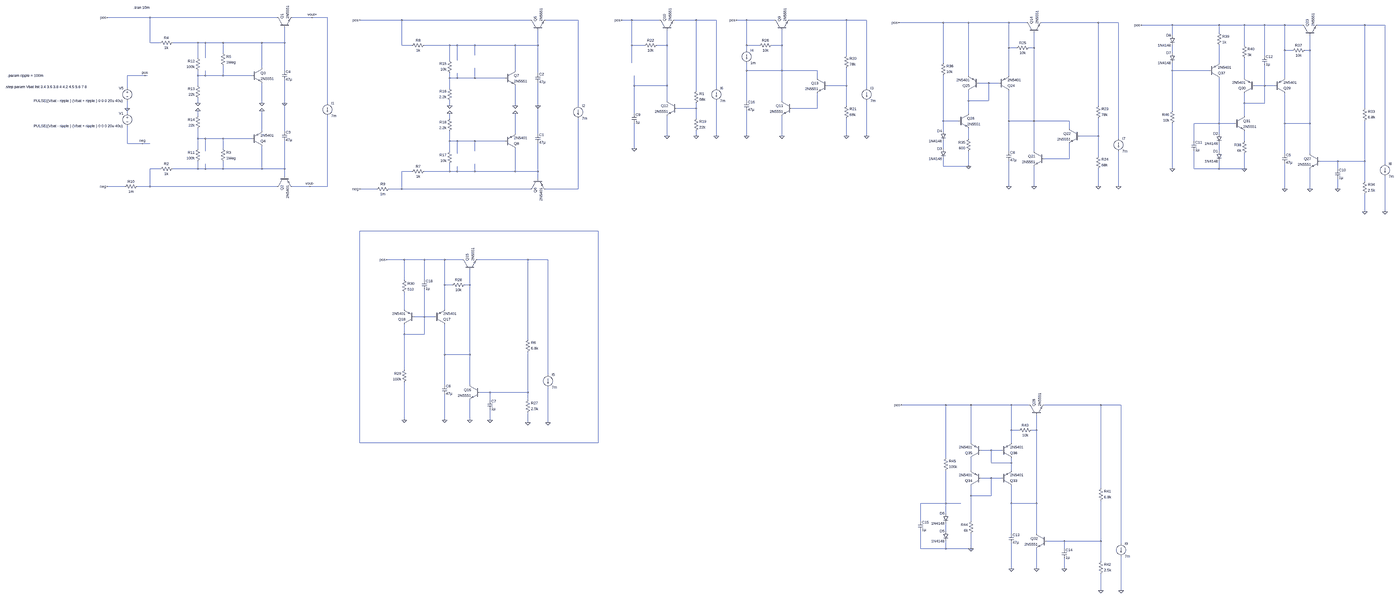
[diagram p0: schematic complete_linear_regulator.asc, whole sheet]
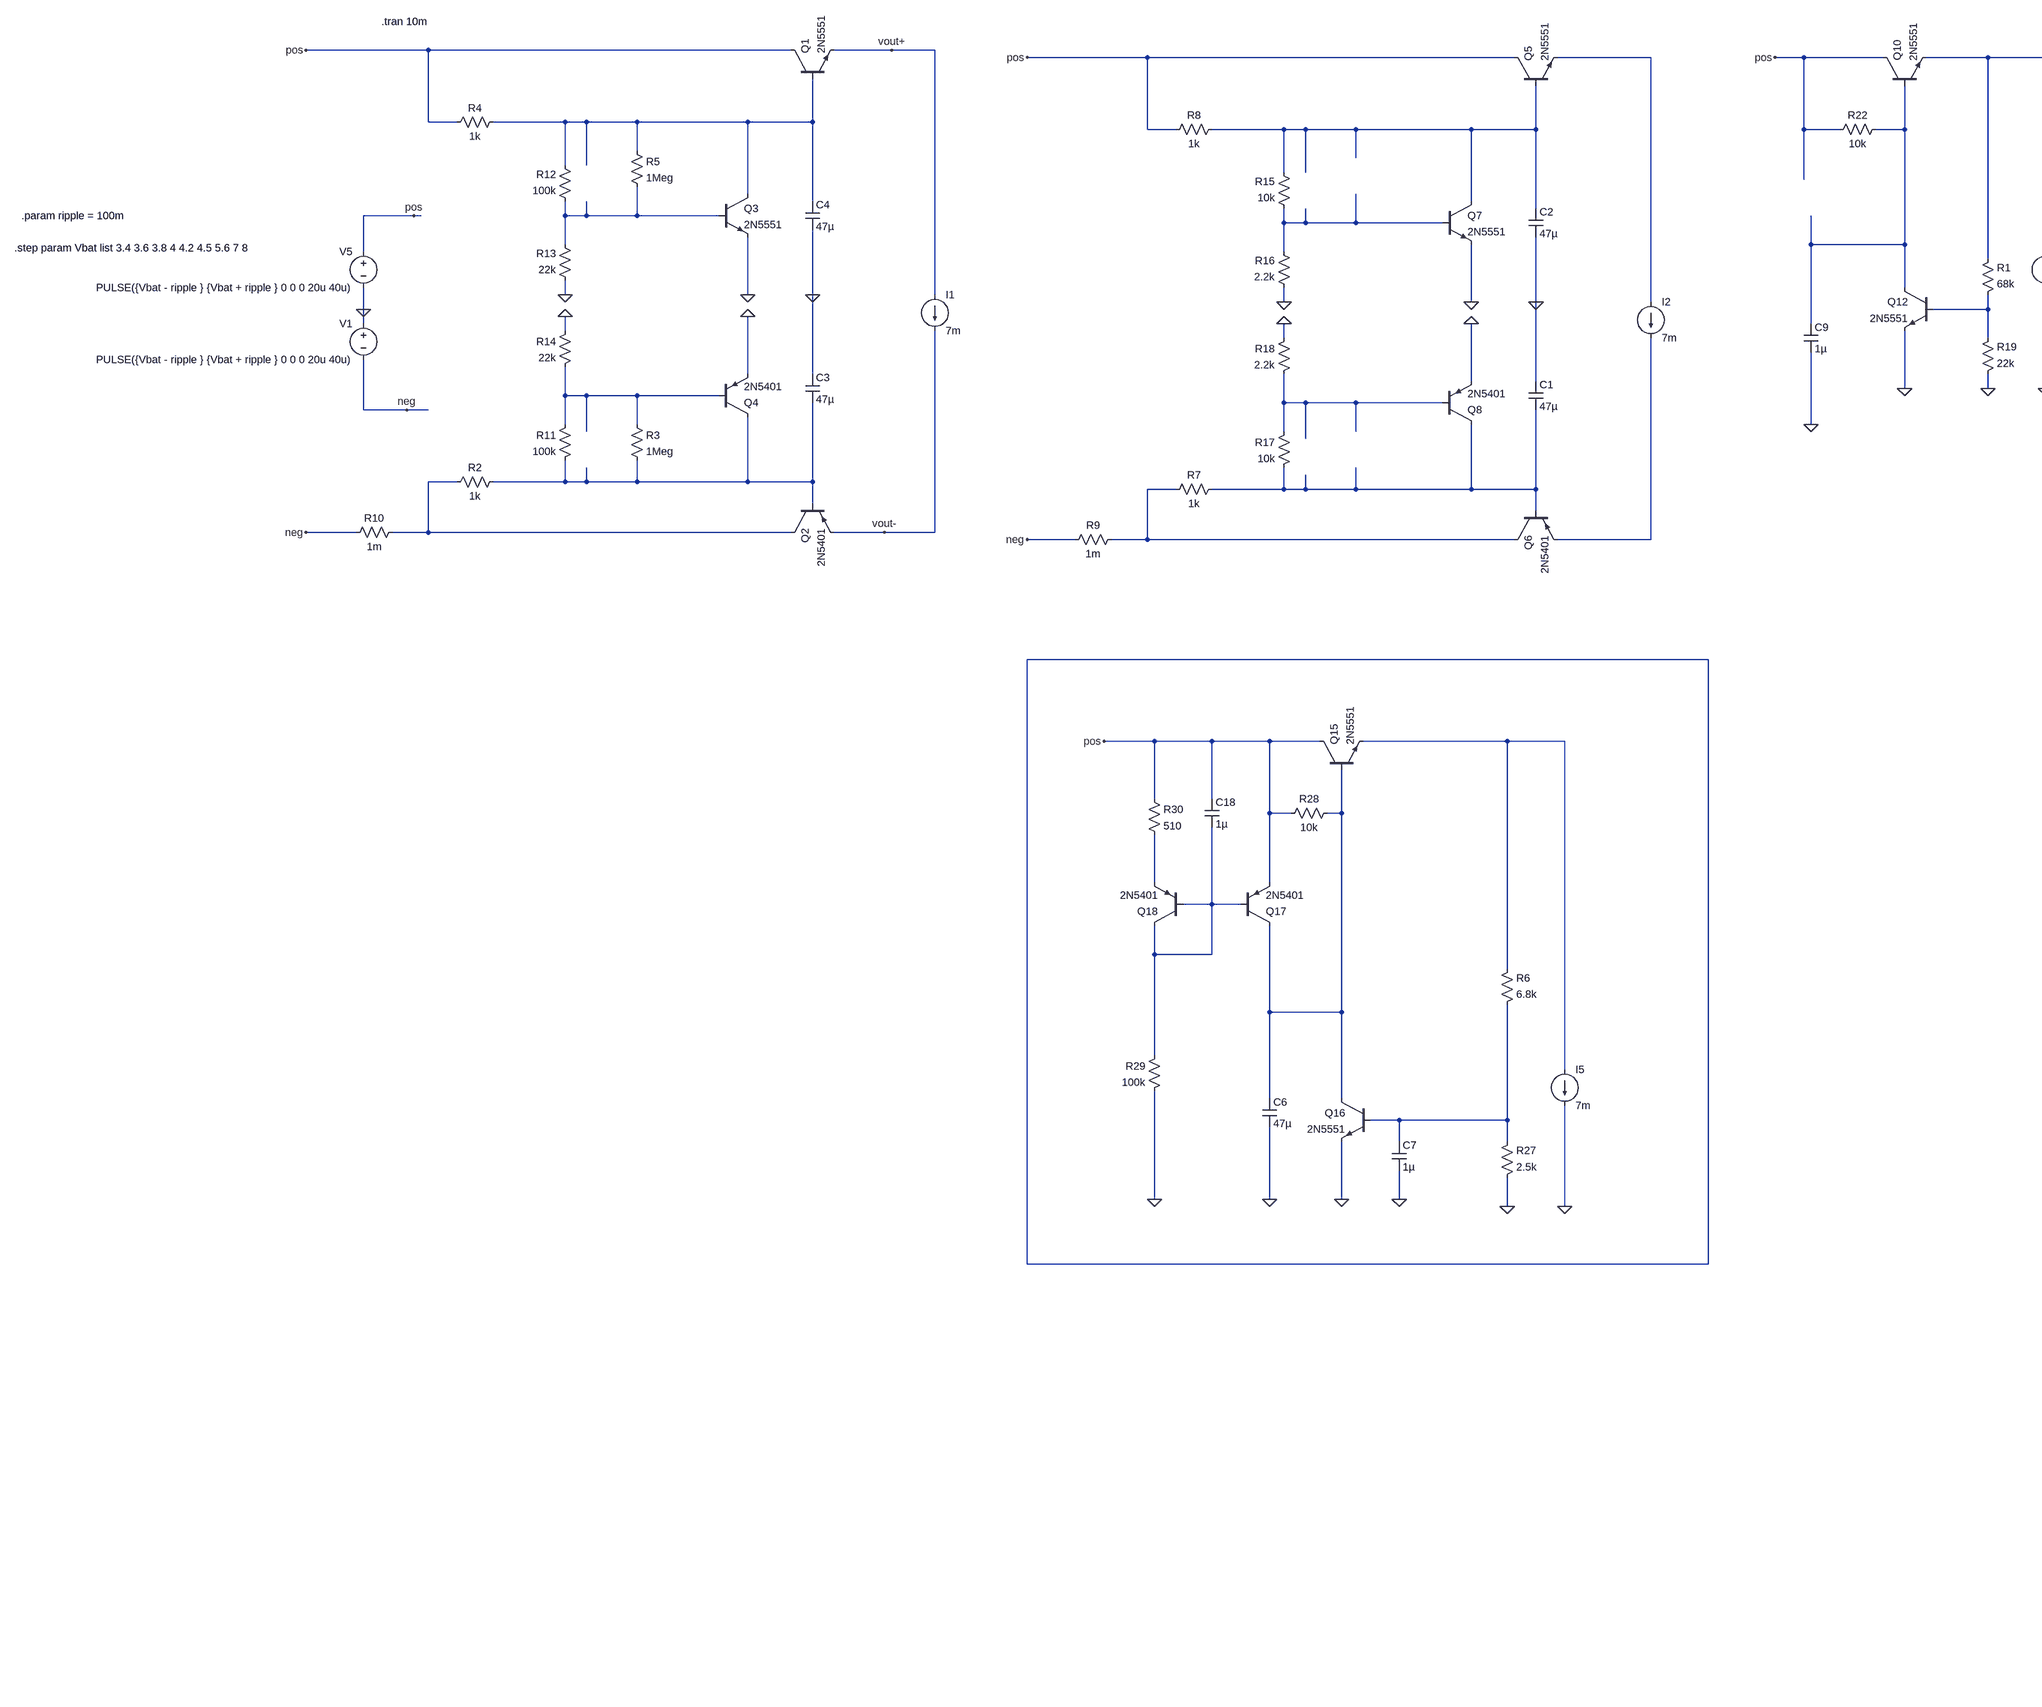
[diagram p1: schematic complete_linear_regulator.asc, part, row 1 of 1, column 1 of 2]
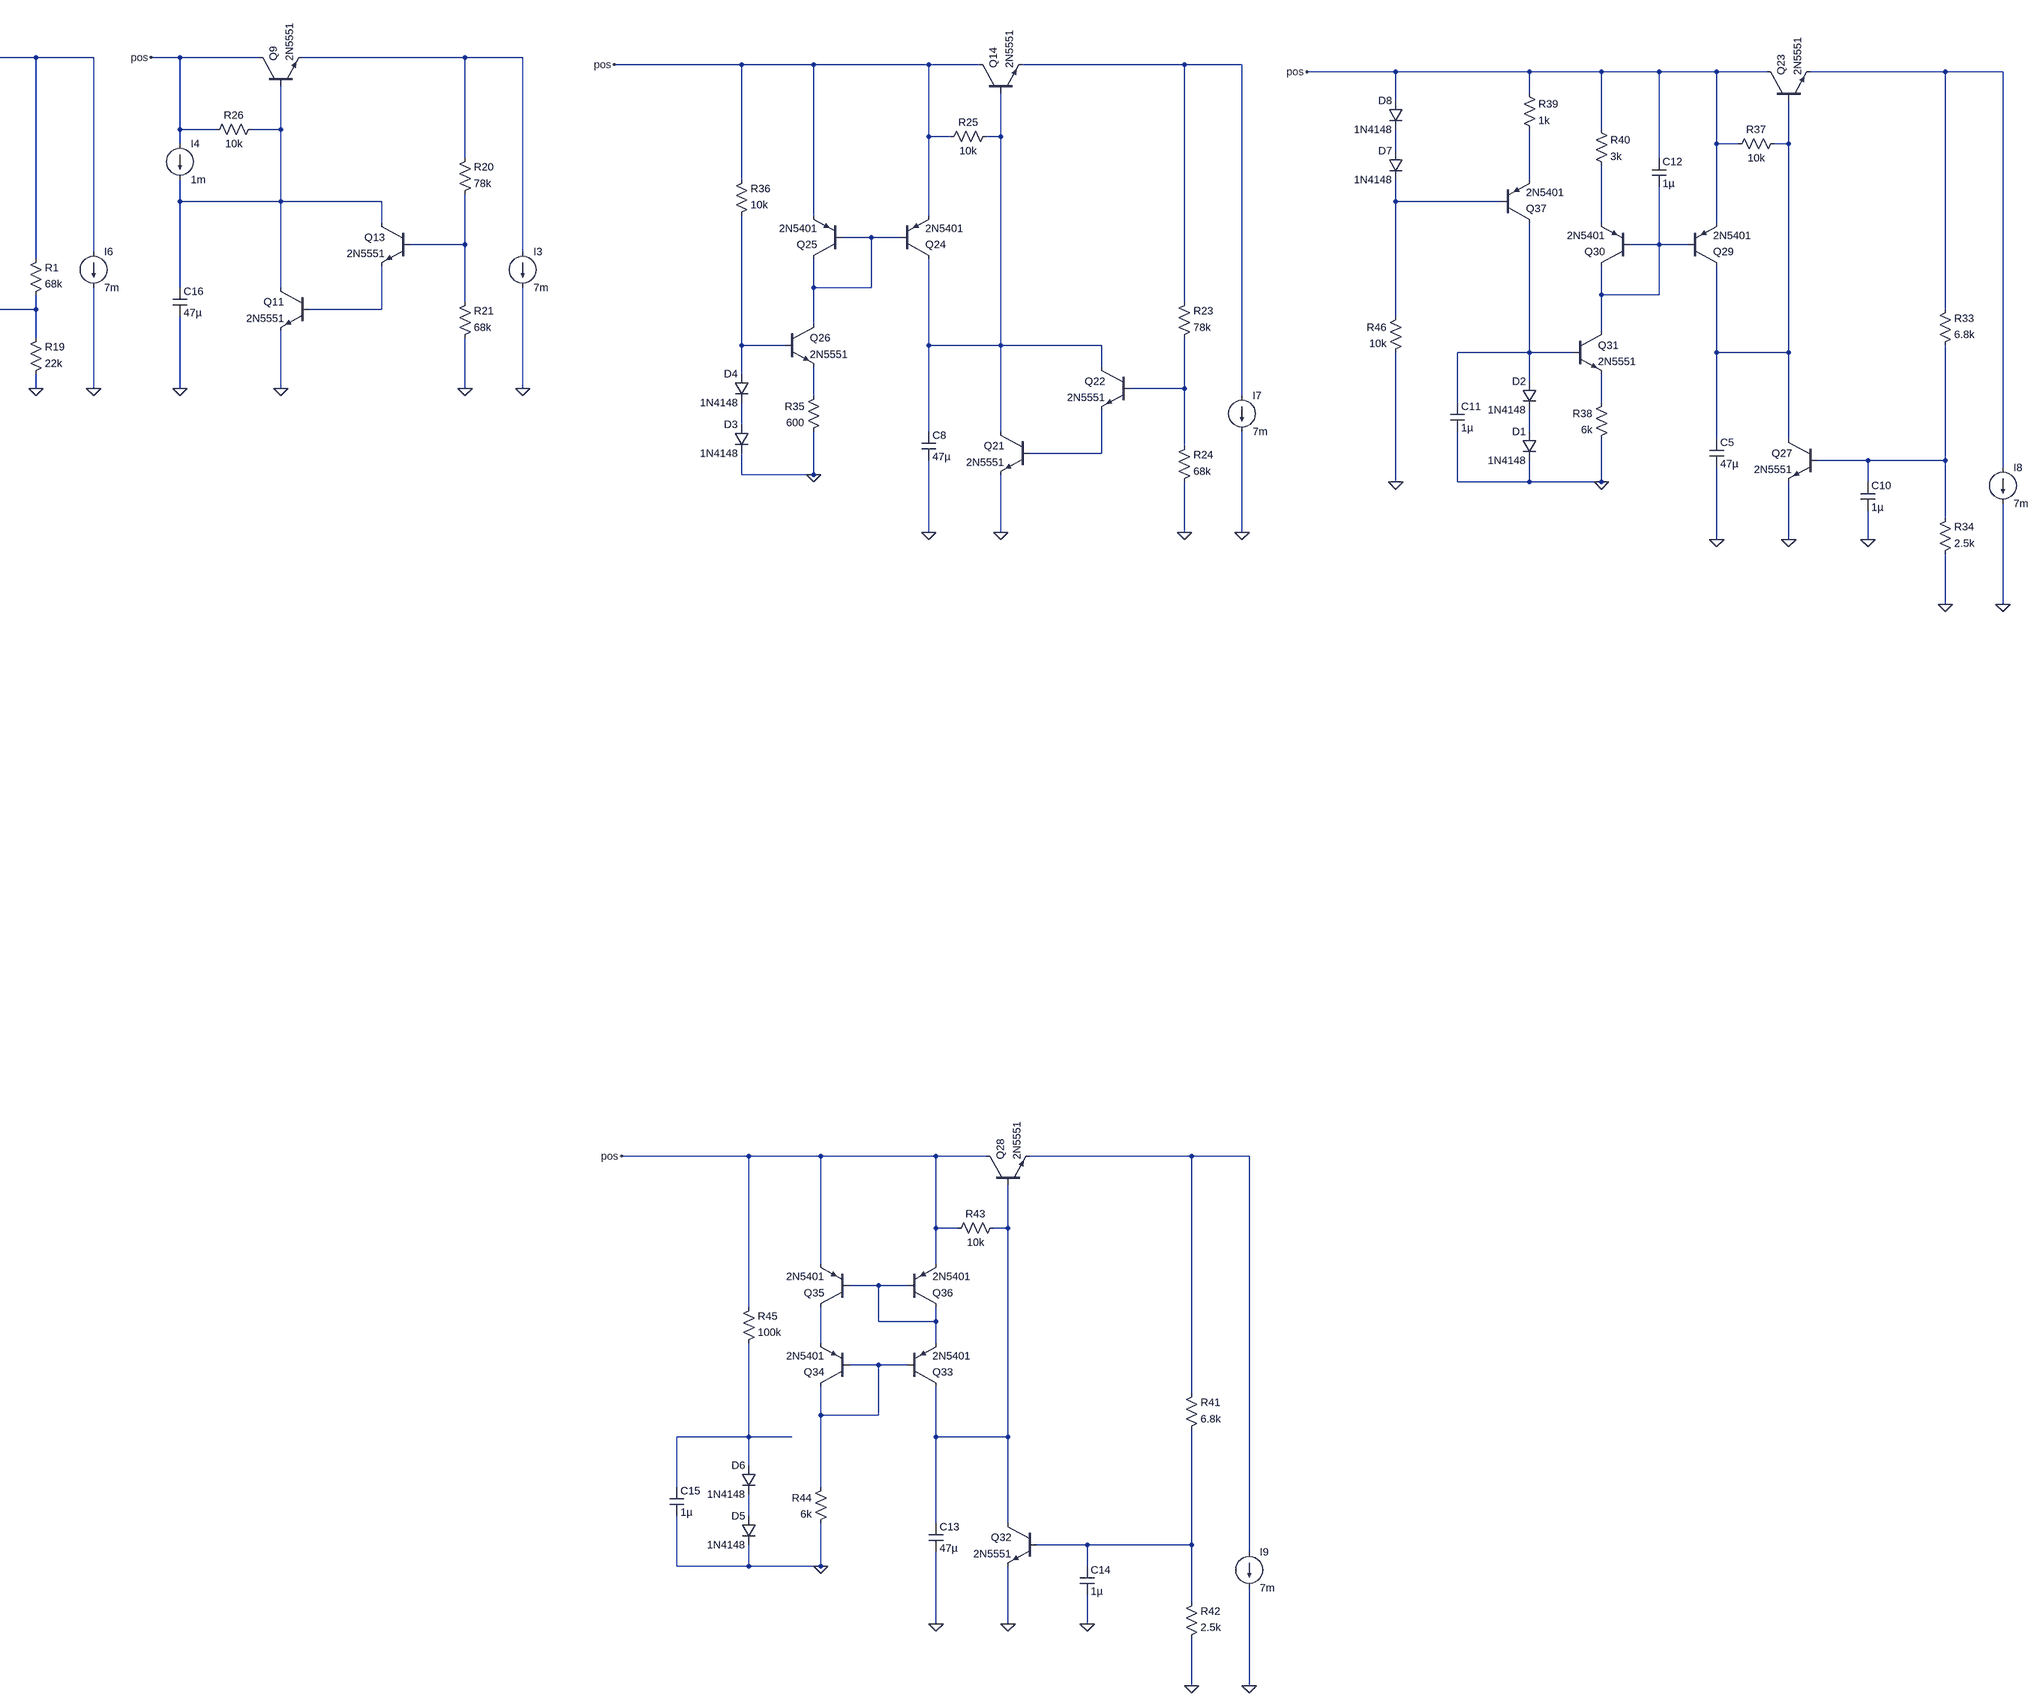
[diagram p2: schematic complete_linear_regulator.asc, part, row 1 of 1, column 2 of 2]
complete_linear_regulator.asc, the LTspice schematic file:
Version 4
SHEET 1 14480 3828
WIRE 3200 112 2928 112
WIRE 4016 112 3200 112
WIRE 4240 112 4112 112
WIRE 4336 112 4240 112
WIRE 5568 128 5296 128
WIRE 6384 128 5568 128
WIRE 6704 128 6480 128
WIRE 7424 128 7360 128
WIRE 7600 128 7424 128
WIRE 8160 128 7696 128
WIRE 8288 128 8160 128
WIRE 8480 128 8416 128
WIRE 8656 128 8480 128
WIRE 9312 128 8752 128
WIRE 9440 128 9312 128
WIRE 10240 144 9680 144
WIRE 10400 144 10240 144
WIRE 10656 144 10400 144
WIRE 10768 144 10656 144
WIRE 11424 144 10864 144
WIRE 11552 144 11424 144
WIRE 11952 160 11696 160
WIRE 12256 160 11952 160
WIRE 12416 160 12256 160
WIRE 12544 160 12416 160
WIRE 12672 160 12544 160
WIRE 12784 160 12672 160
WIRE 13440 160 12880 160
WIRE 13568 160 13440 160
WIRE 12256 208 12256 160
WIRE 11952 224 11952 160
WIRE 3200 272 3200 112
WIRE 3264 272 3200 272
WIRE 3504 272 3344 272
WIRE 3552 272 3504 272
WIRE 3664 272 3552 272
WIRE 3920 272 3664 272
WIRE 4064 272 4064 176
WIRE 4064 272 3920 272
WIRE 5568 288 5568 128
WIRE 5632 288 5568 288
WIRE 5872 288 5712 288
WIRE 5920 288 5872 288
WIRE 6032 288 5920 288
WIRE 6288 288 6032 288
WIRE 6432 288 6432 192
WIRE 6432 288 6288 288
WIRE 7424 288 7424 128
WIRE 7504 288 7424 288
WIRE 7648 288 7648 192
WIRE 7648 288 7584 288
WIRE 8480 288 8480 128
WIRE 8560 288 8480 288
WIRE 8704 288 8704 192
WIRE 8704 288 8640 288
WIRE 12416 288 12416 160
WIRE 10656 304 10656 144
WIRE 10704 304 10656 304
WIRE 10816 304 10816 208
WIRE 10816 304 10784 304
WIRE 8480 320 8480 288
WIRE 12672 320 12672 160
WIRE 12720 320 12672 320
WIRE 12832 320 12832 224
WIRE 12832 320 12800 320
WIRE 3664 336 3664 272
WIRE 11952 336 11952 288
WIRE 6032 352 6032 288
WIRE 9312 352 9312 128
WIRE 12544 352 12544 160
WIRE 3504 368 3504 272
WIRE 3552 368 3552 272
WIRE 5872 384 5872 288
WIRE 5920 384 5920 288
WIRE 7424 400 7424 288
WIRE 10240 400 10240 144
WIRE 12256 400 12256 288
WIRE 3920 432 3920 272
WIRE 4064 448 4064 272
WIRE 6288 448 6288 288
WIRE 8480 448 8480 400
WIRE 8704 448 8704 288
WIRE 8704 448 8480 448
WIRE 8928 448 8704 448
WIRE 11952 448 11952 400
WIRE 12192 448 11952 448
WIRE 6432 464 6432 288
WIRE 3168 480 3056 480
WIRE 3184 480 3168 480
WIRE 3504 480 3504 448
WIRE 3552 480 3552 448
WIRE 3552 480 3504 480
WIRE 3664 480 3664 416
WIRE 3664 480 3552 480
WIRE 3856 480 3664 480
WIRE 10400 480 10400 144
WIRE 10656 480 10656 304
WIRE 5872 496 5872 464
WIRE 5920 496 5920 464
WIRE 5920 496 5872 496
WIRE 6032 496 6032 432
WIRE 6032 496 5920 496
WIRE 6224 496 6032 496
WIRE 8928 496 8928 448
WIRE 12416 496 12416 368
WIRE 12672 496 12672 320
WIRE 10528 528 10464 528
WIRE 10592 528 10528 528
WIRE 3504 544 3504 480
WIRE 7440 544 7440 480
WIRE 7648 544 7648 288
WIRE 7648 544 7440 544
WIRE 9312 544 9312 432
WIRE 9312 544 8992 544
WIRE 12544 544 12544 416
WIRE 12544 544 12480 544
WIRE 12608 544 12544 544
WIRE 3056 560 3056 480
WIRE 5872 560 5872 496
WIRE 8288 560 8288 128
WIRE 9440 560 9440 128
WIRE 8160 576 8160 128
WIRE 7648 640 7648 544
WIRE 8480 640 8480 448
WIRE 8704 640 8704 448
WIRE 10400 640 10400 576
WIRE 10528 640 10528 528
WIRE 10528 640 10400 640
WIRE 3504 656 3504 624
WIRE 3920 656 3920 528
WIRE 4064 656 4064 512
WIRE 4336 656 4336 112
WIRE 12416 656 12416 592
WIRE 12544 656 12544 544
WIRE 12544 656 12416 656
WIRE 5872 672 5872 640
WIRE 6288 672 6288 544
WIRE 6432 672 6432 528
WIRE 6704 672 6704 128
WIRE 9312 672 9312 544
WIRE 11424 672 11424 144
WIRE 3056 688 3056 640
WIRE 8160 688 8160 656
WIRE 8160 688 7712 688
WIRE 8928 688 8928 592
WIRE 8928 688 8768 688
WIRE 13440 688 13440 160
WIRE 11952 704 11952 448
WIRE 3056 720 3056 688
WIRE 7440 720 7440 544
WIRE 10400 720 10400 640
WIRE 3504 736 3504 704
WIRE 12416 736 12416 656
WIRE 5872 752 5872 720
WIRE 8160 752 8160 688
WIRE 10240 768 10240 480
WIRE 10336 768 10240 768
WIRE 10656 768 10656 576
WIRE 10816 768 10816 304
WIRE 10816 768 10656 768
WIRE 11040 768 10816 768
WIRE 12256 784 12256 496
WIRE 12256 784 12096 784
WIRE 12352 784 12256 784
WIRE 12672 784 12672 592
WIRE 12832 784 12832 320
WIRE 12832 784 12672 784
WIRE 11040 816 11040 768
WIRE 3920 832 3920 704
WIRE 4064 832 4064 656
WIRE 10240 832 10240 768
WIRE 6288 848 6288 720
WIRE 6432 848 6432 672
WIRE 12256 848 12256 784
WIRE 7648 864 7648 736
WIRE 7664 864 7648 864
WIRE 8160 864 8160 832
WIRE 8288 864 8288 640
WIRE 8480 864 8480 704
WIRE 8704 864 8704 736
WIRE 8720 864 8704 864
WIRE 9312 864 9312 752
WIRE 9440 864 9440 640
WIRE 11424 864 11424 752
WIRE 11424 864 11104 864
WIRE 3504 880 3504 816
WIRE 3552 880 3504 880
WIRE 3664 880 3552 880
WIRE 3856 880 3664 880
WIRE 10400 880 10400 816
WIRE 11552 880 11552 144
WIRE 5872 896 5872 832
WIRE 5920 896 5872 896
WIRE 6032 896 5920 896
WIRE 6224 896 6032 896
WIRE 12096 896 12096 784
WIRE 12416 896 12416 832
WIRE 3056 912 3056 800
WIRE 3152 912 3056 912
WIRE 3200 912 3152 912
WIRE 3504 944 3504 880
WIRE 3664 944 3664 880
WIRE 7440 944 7440 784
WIRE 10240 944 10240 896
WIRE 3552 960 3552 880
WIRE 5872 960 5872 896
WIRE 6032 960 6032 896
WIRE 10656 960 10656 768
WIRE 10816 960 10816 768
WIRE 12256 960 12256 912
WIRE 5920 976 5920 896
WIRE 12672 976 12672 784
WIRE 12832 976 12832 784
WIRE 11424 992 11424 864
WIRE 11040 1008 11040 912
WIRE 11040 1008 10880 1008
WIRE 13008 1024 12896 1024
WIRE 13440 1024 13440 768
WIRE 13440 1024 13008 1024
WIRE 13568 1040 13568 160
WIRE 10240 1056 10240 1008
WIRE 10400 1056 10400 960
WIRE 10400 1056 10240 1056
WIRE 10416 1056 10400 1056
WIRE 3264 1072 3200 1072
WIRE 3504 1072 3504 1024
WIRE 3504 1072 3344 1072
WIRE 3552 1072 3552 1040
WIRE 3552 1072 3504 1072
WIRE 3664 1072 3664 1024
WIRE 3664 1072 3552 1072
WIRE 3920 1072 3920 928
WIRE 3920 1072 3664 1072
WIRE 4064 1072 4064 896
WIRE 4064 1072 3920 1072
WIRE 11952 1072 11952 784
WIRE 12096 1072 12096 960
WIRE 12256 1072 12256 1024
WIRE 12256 1072 12096 1072
WIRE 12416 1072 12416 976
WIRE 12416 1072 12256 1072
WIRE 12432 1072 12416 1072
WIRE 13008 1072 13008 1024
WIRE 5632 1088 5568 1088
WIRE 5872 1088 5872 1040
WIRE 5872 1088 5712 1088
WIRE 5920 1088 5920 1056
WIRE 5920 1088 5872 1088
WIRE 6032 1088 6032 1040
WIRE 6032 1088 5920 1088
WIRE 6288 1088 6288 944
WIRE 6288 1088 6032 1088
WIRE 6432 1088 6432 912
WIRE 6432 1088 6288 1088
WIRE 4064 1120 4064 1072
WIRE 6432 1136 6432 1088
WIRE 13440 1152 13440 1024
WIRE 3040 1184 2928 1184
WIRE 3200 1184 3200 1072
WIRE 3200 1184 3120 1184
WIRE 4016 1184 3200 1184
WIRE 4224 1184 4112 1184
WIRE 4336 1184 4336 736
WIRE 4336 1184 4224 1184
WIRE 10656 1184 10656 1024
WIRE 10816 1184 10816 1056
WIRE 10832 1184 10816 1184
WIRE 11424 1184 11424 1072
WIRE 11552 1184 11552 960
WIRE 5408 1200 5296 1200
WIRE 5568 1200 5568 1088
WIRE 5568 1200 5488 1200
WIRE 6384 1200 5568 1200
WIRE 6704 1200 6704 752
WIRE 6704 1200 6480 1200
WIRE 12672 1200 12672 1040
WIRE 12832 1200 12832 1072
WIRE 12848 1200 12832 1200
WIRE 13008 1200 13008 1136
WIRE 13440 1344 13440 1232
WIRE 13568 1344 13568 1120
WIRE 6832 1488 5296 1488
WIRE 5584 1680 5472 1680
WIRE 5712 1680 5584 1680
WIRE 5840 1680 5712 1680
WIRE 5952 1680 5840 1680
WIRE 6368 1680 6048 1680
WIRE 6496 1680 6368 1680
WIRE 5584 1808 5584 1680
WIRE 5712 1808 5712 1680
WIRE 5840 1840 5840 1680
WIRE 5888 1840 5840 1840
WIRE 6000 1840 6000 1744
WIRE 6000 1840 5968 1840
WIRE 5584 2016 5584 1888
WIRE 5840 2016 5840 1840
WIRE 5712 2064 5712 1872
WIRE 5712 2064 5648 2064
WIRE 5776 2064 5712 2064
WIRE 5584 2176 5584 2112
WIRE 5712 2176 5712 2064
WIRE 5712 2176 5584 2176
WIRE 6368 2208 6368 1680
WIRE 5840 2304 5840 2112
WIRE 6000 2304 6000 1840
WIRE 6000 2304 5840 2304
WIRE 5584 2400 5584 2176
WIRE 6496 2432 6496 1680
WIRE 5840 2496 5840 2304
WIRE 6000 2496 6000 2304
WIRE 6128 2544 6064 2544
WIRE 6368 2544 6368 2288
WIRE 6368 2544 6128 2544
WIRE 6128 2592 6128 2544
WIRE 6368 2592 6368 2544
WIRE 10256 2624 9696 2624
WIRE 10416 2624 10256 2624
WIRE 10672 2624 10416 2624
WIRE 10784 2624 10672 2624
WIRE 11440 2624 10880 2624
WIRE 11568 2624 11440 2624
WIRE 5584 2720 5584 2480
WIRE 5600 2720 5584 2720
WIRE 5840 2720 5840 2560
WIRE 6000 2720 6000 2592
WIRE 6016 2720 6000 2720
WIRE 6128 2720 6128 2656
WIRE 6368 2736 6368 2672
WIRE 6496 2736 6496 2512
WIRE 10672 2784 10672 2624
WIRE 10720 2784 10672 2784
WIRE 10832 2784 10832 2688
WIRE 10832 2784 10800 2784
WIRE 5296 2864 5296 1488
WIRE 6832 2864 6832 1488
WIRE 6832 2864 5296 2864
WIRE 10416 2864 10416 2624
WIRE 10672 2864 10672 2784
WIRE 10544 2912 10480 2912
WIRE 10608 2912 10544 2912
WIRE 10256 2960 10256 2624
WIRE 10544 2992 10544 2912
WIRE 10672 2992 10672 2960
WIRE 10672 2992 10544 2992
WIRE 10416 3040 10416 2960
WIRE 10672 3040 10672 2992
WIRE 10544 3088 10480 3088
WIRE 10608 3088 10544 3088
WIRE 11440 3152 11440 2624
WIRE 10416 3200 10416 3136
WIRE 10544 3200 10544 3088
WIRE 10544 3200 10416 3200
WIRE 10256 3248 10256 3040
WIRE 10256 3248 10096 3248
WIRE 10352 3248 10256 3248
WIRE 10672 3248 10672 3136
WIRE 10832 3248 10832 2784
WIRE 10832 3248 10672 3248
WIRE 10256 3312 10256 3248
WIRE 10096 3360 10096 3248
WIRE 10416 3360 10416 3200
WIRE 10256 3424 10256 3376
WIRE 10672 3440 10672 3248
WIRE 10832 3440 10832 3248
WIRE 11008 3488 10896 3488
WIRE 11440 3488 11440 3232
WIRE 11440 3488 11008 3488
WIRE 11568 3504 11568 2624
WIRE 10096 3536 10096 3424
WIRE 10256 3536 10256 3488
WIRE 10256 3536 10096 3536
WIRE 10416 3536 10416 3440
WIRE 10416 3536 10256 3536
WIRE 10432 3536 10416 3536
WIRE 11008 3536 11008 3488
WIRE 11440 3616 11440 3488
WIRE 10672 3664 10672 3504
WIRE 10832 3664 10832 3536
WIRE 10848 3664 10832 3664
WIRE 11008 3664 11008 3600
WIRE 11440 3808 11440 3696
WIRE 11568 3808 11568 3584
FLAG 4240 112 vout+
FLAG 4224 1184 vout-
FLAG 2928 112 pos
FLAG 2928 1184 neg
FLAG 4064 656 0
FLAG 3920 656 0
FLAG 3504 656 0
FLAG 3168 480 pos
FLAG 3152 912 neg
FLAG 3504 704 0
FLAG 3920 704 0
FLAG 5296 128 pos
FLAG 5296 1200 neg
FLAG 6432 672 0
FLAG 6288 672 0
FLAG 5872 672 0
FLAG 5872 720 0
FLAG 6288 720 0
FLAG 8416 128 pos
FLAG 9312 864 0
FLAG 8704 864 0
FLAG 9440 864 0
FLAG 7360 128 pos
FLAG 8160 864 0
FLAG 7648 864 0
FLAG 8288 864 0
FLAG 3056 688 0
FLAG 9680 144 pos
FLAG 11424 1184 0
FLAG 10816 1184 0
FLAG 11552 1184 0
FLAG 10400 1056 0
FLAG 11696 160 pos
FLAG 13440 1344 0
FLAG 12832 1200 0
FLAG 13568 1344 0
FLAG 12416 1072 0
FLAG 12672 1200 0
FLAG 10656 1184 0
FLAG 7440 944 0
FLAG 13008 1200 0
FLAG 9696 2624 pos
FLAG 11440 3808 0
FLAG 10832 3664 0
FLAG 11568 3808 0
FLAG 10416 3536 0
FLAG 10672 3664 0
FLAG 11008 3664 0
FLAG 8480 864 0
FLAG 11952 1072 0
FLAG 5472 1680 pos
FLAG 6368 2736 0
FLAG 6000 2720 0
FLAG 6496 2736 0
FLAG 5584 2720 0
FLAG 5840 2720 0
FLAG 6128 2720 0
SYMBOL voltage 3056 544 M0
WINDOW 123 0 0 Left 0
WINDOW 39 0 0 Left 0
SYMATTR InstName V5
SYMATTR Value PULSE({Vbat - ripple } {Vbat + ripple } 0 0 0 20u 40u)
SYMBOL npn 4016 176 R270
SYMATTR InstName Q1
SYMATTR Value 2N5551
SYMBOL res 3360 1056 R90
WINDOW 0 0 56 VBottom 2
WINDOW 3 32 56 VTop 2
SYMATTR InstName R2
SYMATTR Value 1k
SYMBOL pnp 4016 1120 M90
SYMATTR InstName Q2
SYMATTR Value 2N5401
SYMBOL cap 4048 832 R0
SYMATTR InstName C3
SYMATTR Value 47µ
SYMBOL res 3360 256 R90
WINDOW 0 0 56 VBottom 2
WINDOW 3 32 56 VTop 2
SYMATTR InstName R4
SYMATTR Value 1k
SYMBOL res 3136 1168 R90
WINDOW 0 0 56 VBottom 2
WINDOW 3 32 56 VTop 2
SYMATTR InstName R10
SYMATTR Value 1m
SYMBOL cap 4048 448 R0
SYMATTR InstName C4
SYMATTR Value 47µ
SYMBOL npn 3856 432 R0
SYMATTR InstName Q3
SYMATTR Value 2N5551
SYMBOL res 3520 464 R180
WINDOW 0 36 76 Left 2
WINDOW 3 36 40 Left 2
SYMATTR InstName R12
SYMATTR Value 100k
SYMBOL res 3520 640 R180
WINDOW 0 36 76 Left 2
WINDOW 3 36 40 Left 2
SYMATTR InstName R13
SYMATTR Value 22k
SYMBOL pnp 3856 928 M180
SYMATTR InstName Q4
SYMATTR Value 2N5401
SYMBOL res 3520 928 M0
SYMATTR InstName R11
SYMATTR Value 100k
SYMBOL res 3520 720 M0
SYMATTR InstName R14
SYMATTR Value 22k
SYMBOL current 4336 656 R0
WINDOW 123 0 0 Left 0
WINDOW 39 0 0 Left 0
SYMATTR InstName I1
SYMATTR Value 7m
SYMBOL res 3648 928 R0
SYMATTR InstName R3
SYMATTR Value 1Meg
SYMBOL res 3648 320 R0
SYMATTR InstName R5
SYMATTR Value 1Meg
SYMBOL voltage 3056 704 M0
WINDOW 123 0 0 Left 0
WINDOW 39 0 0 Left 0
SYMATTR InstName V1
SYMATTR Value PULSE({Vbat - ripple } {Vbat + ripple } 0 0 0 20u 40u)
SYMBOL npn 6384 192 R270
SYMATTR InstName Q5
SYMATTR Value 2N5551
SYMBOL res 5728 1072 R90
WINDOW 0 0 56 VBottom 2
WINDOW 3 32 56 VTop 2
SYMATTR InstName R7
SYMATTR Value 1k
SYMBOL pnp 6384 1136 M90
SYMATTR InstName Q6
SYMATTR Value 2N5401
SYMBOL cap 6416 848 R0
SYMATTR InstName C1
SYMATTR Value 47µ
SYMBOL res 5728 272 R90
WINDOW 0 0 56 VBottom 2
WINDOW 3 32 56 VTop 2
SYMATTR InstName R8
SYMATTR Value 1k
SYMBOL res 5504 1184 R90
WINDOW 0 0 56 VBottom 2
WINDOW 3 32 56 VTop 2
SYMATTR InstName R9
SYMATTR Value 1m
SYMBOL cap 6416 464 R0
SYMATTR InstName C2
SYMATTR Value 47µ
SYMBOL npn 6224 448 R0
SYMATTR InstName Q7
SYMATTR Value 2N5551
SYMBOL res 5888 480 R180
WINDOW 0 36 76 Left 2
WINDOW 3 36 40 Left 2
SYMATTR InstName R15
SYMATTR Value 10k
SYMBOL res 5888 656 R180
WINDOW 0 36 76 Left 2
WINDOW 3 36 40 Left 2
SYMATTR InstName R16
SYMATTR Value 2.2k
SYMBOL pnp 6224 944 M180
SYMATTR InstName Q8
SYMATTR Value 2N5401
SYMBOL res 5888 944 M0
SYMATTR InstName R17
SYMATTR Value 10k
SYMBOL res 5888 736 M0
SYMATTR InstName R18
SYMATTR Value 2.2k
SYMBOL current 6704 672 R0
WINDOW 123 0 0 Left 0
WINDOW 39 0 0 Left 0
SYMATTR InstName I2
SYMATTR Value 7m
SYMBOL npn 8656 192 R270
SYMATTR InstName Q9
SYMATTR Value 2N5551
SYMBOL npn 8768 640 M0
SYMATTR InstName Q11
SYMATTR Value 2N5551
SYMBOL res 9296 448 M180
WINDOW 0 36 76 Left 2
WINDOW 3 36 40 Left 2
SYMATTR InstName R20
SYMATTR Value 78k
SYMBOL res 9296 768 M180
WINDOW 0 36 76 Left 2
WINDOW 3 36 40 Left 2
SYMATTR InstName R21
SYMATTR Value 68k
SYMBOL current 9440 560 R0
WINDOW 123 0 0 Left 0
WINDOW 39 0 0 Left 0
SYMATTR InstName I3
SYMATTR Value 7m
SYMBOL res 8544 304 R270
WINDOW 0 32 56 VTop 2
WINDOW 3 0 56 VBottom 2
SYMATTR InstName R26
SYMATTR Value 10k
SYMBOL current 8480 320 R0
WINDOW 123 0 0 Left 0
WINDOW 39 0 0 Left 0
SYMATTR InstName I4
SYMATTR Value 1m
SYMBOL npn 7600 192 R270
SYMATTR InstName Q10
SYMATTR Value 2N5551
SYMBOL npn 7712 640 M0
SYMATTR InstName Q12
SYMATTR Value 2N5551
SYMBOL res 8144 672 M180
WINDOW 0 36 76 Left 2
WINDOW 3 36 40 Left 2
SYMATTR InstName R1
SYMATTR Value 68k
SYMBOL res 8144 848 M180
WINDOW 0 36 76 Left 2
WINDOW 3 36 40 Left 2
SYMATTR InstName R19
SYMATTR Value 22k
SYMBOL current 8288 560 R0
WINDOW 123 0 0 Left 0
WINDOW 39 0 0 Left 0
SYMATTR InstName I6
SYMATTR Value 7m
SYMBOL res 7488 304 R270
WINDOW 0 32 56 VTop 2
WINDOW 3 0 56 VBottom 2
SYMATTR InstName R22
SYMATTR Value 10k
SYMBOL npn 8992 496 M0
SYMATTR InstName Q13
SYMATTR Value 2N5551
SYMBOL npn 10768 208 R270
SYMATTR InstName Q14
SYMATTR Value 2N5551
SYMBOL npn 10880 960 M0
SYMATTR InstName Q21
SYMATTR Value 2N5551
SYMBOL res 11408 768 M180
WINDOW 0 36 76 Left 2
WINDOW 3 36 40 Left 2
SYMATTR InstName R23
SYMATTR Value 78k
SYMBOL res 11408 1088 M180
WINDOW 0 36 76 Left 2
WINDOW 3 36 40 Left 2
SYMATTR InstName R24
SYMATTR Value 68k
SYMBOL current 11552 880 R0
WINDOW 123 0 0 Left 0
WINDOW 39 0 0 Left 0
SYMATTR InstName I7
SYMATTR Value 7m
SYMBOL res 10688 320 R270
WINDOW 0 32 56 VTop 2
WINDOW 3 0 56 VBottom 2
SYMATTR InstName R25
SYMATTR Value 10k
SYMBOL npn 11104 816 M0
SYMATTR InstName Q22
SYMATTR Value 2N5551
SYMBOL pnp 10592 576 M180
SYMATTR InstName Q24
SYMATTR Value 2N5401
SYMBOL pnp 10464 576 R180
SYMATTR InstName Q25
SYMATTR Value 2N5401
SYMBOL npn 10336 720 R0
SYMATTR InstName Q26
SYMATTR Value 2N5551
SYMBOL res 10416 864 M0
SYMATTR InstName R35
SYMATTR Value 600
SYMBOL diode 10256 944 M0
SYMATTR InstName D3
SYMATTR Value 1N4148
SYMBOL diode 10256 832 M0
SYMATTR InstName D4
SYMATTR Value 1N4148
SYMBOL res 10224 496 M180
WINDOW 0 36 76 Left 2
WINDOW 3 36 40 Left 2
SYMATTR InstName R36
SYMATTR Value 10k
SYMBOL npn 12784 224 R270
SYMATTR InstName Q23
SYMATTR Value 2N5551
SYMBOL npn 12896 976 M0
SYMATTR InstName Q27
SYMATTR Value 2N5551
SYMBOL res 13424 784 M180
WINDOW 0 36 76 Left 2
WINDOW 3 36 40 Left 2
SYMATTR InstName R33
SYMATTR Value 6.8k
SYMBOL res 13424 1248 M180
WINDOW 0 36 76 Left 2
WINDOW 3 36 40 Left 2
SYMATTR InstName R34
SYMATTR Value 2.5k
SYMBOL current 13568 1040 R0
WINDOW 123 0 0 Left 0
WINDOW 39 0 0 Left 0
SYMATTR InstName I8
SYMATTR Value 7m
SYMBOL res 12704 336 R270
WINDOW 0 32 56 VTop 2
WINDOW 3 0 56 VBottom 2
SYMATTR InstName R37
SYMATTR Value 10k
SYMBOL pnp 12608 592 M180
SYMATTR InstName Q29
SYMATTR Value 2N5401
SYMBOL pnp 12480 592 R180
SYMATTR InstName Q30
SYMATTR Value 2N5401
SYMBOL npn 12352 736 R0
SYMATTR InstName Q31
SYMATTR Value 2N5551
SYMBOL res 12432 880 M0
SYMATTR InstName R38
SYMATTR Value 6k
SYMBOL diode 12272 960 M0
SYMATTR InstName D1
SYMATTR Value 1N4148
SYMBOL diode 12272 848 M0
SYMATTR InstName D2
SYMATTR Value 1N4148
SYMBOL cap 12656 976 R0
SYMATTR InstName C5
SYMATTR Value 47µ
SYMBOL cap 10640 960 R0
SYMATTR InstName C8
SYMATTR Value 47µ
SYMBOL cap 7424 720 R0
SYMATTR InstName C9
SYMATTR Value 1µ
SYMBOL cap 12992 1072 R0
SYMATTR InstName C10
SYMATTR Value 1µ
SYMBOL res 12400 272 R0
SYMATTR InstName R40
SYMATTR Value 3k
SYMBOL cap 12080 896 R0
SYMATTR InstName C11
SYMATTR Value 1µ
SYMBOL cap 12528 352 R0
SYMATTR InstName C12
SYMATTR Value 1µ
SYMBOL npn 10784 2688 R270
SYMATTR InstName Q28
SYMATTR Value 2N5551
SYMBOL npn 10896 3440 M0
SYMATTR InstName Q32
SYMATTR Value 2N5551
SYMBOL res 11424 3248 M180
WINDOW 0 36 76 Left 2
WINDOW 3 36 40 Left 2
SYMATTR InstName R41
SYMATTR Value 6.8k
SYMBOL res 11424 3712 M180
WINDOW 0 36 76 Left 2
WINDOW 3 36 40 Left 2
SYMATTR InstName R42
SYMATTR Value 2.5k
SYMBOL current 11568 3504 R0
WINDOW 123 0 0 Left 0
WINDOW 39 0 0 Left 0
SYMATTR InstName I9
SYMATTR Value 7m
SYMBOL res 10704 2800 R270
WINDOW 0 32 56 VTop 2
WINDOW 3 0 56 VBottom 2
SYMATTR InstName R43
SYMATTR Value 10k
SYMBOL pnp 10608 3136 M180
SYMATTR InstName Q33
SYMATTR Value 2N5401
SYMBOL pnp 10480 3136 R180
SYMATTR InstName Q34
SYMATTR Value 2N5401
SYMBOL res 10432 3344 M0
SYMATTR InstName R44
SYMATTR Value 6k
SYMBOL diode 10272 3424 M0
SYMATTR InstName D5
SYMATTR Value 1N4148
SYMBOL diode 10272 3312 M0
SYMATTR InstName D6
SYMATTR Value 1N4148
SYMBOL res 10240 3056 M180
WINDOW 0 36 76 Left 2
WINDOW 3 36 40 Left 2
SYMATTR InstName R45
SYMATTR Value 100k
SYMBOL cap 10656 3440 R0
SYMATTR InstName C13
SYMATTR Value 47µ
SYMBOL cap 10992 3536 R0
SYMATTR InstName C14
SYMATTR Value 1µ
SYMBOL cap 10080 3360 R0
SYMATTR InstName C15
SYMATTR Value 1µ
SYMBOL pnp 10608 2960 M180
SYMATTR InstName Q36
SYMATTR Value 2N5401
SYMBOL pnp 10480 2960 R180
SYMATTR InstName Q35
SYMATTR Value 2N5401
SYMBOL cap 8464 640 R0
SYMATTR InstName C16
SYMATTR Value 47µ
SYMBOL pnp 12192 496 M180
SYMATTR InstName Q37
SYMATTR Value 2N5401
SYMBOL res 12240 192 R0
SYMATTR InstName R39
SYMATTR Value 1k
SYMBOL diode 11968 336 M0
SYMATTR InstName D7
SYMATTR Value 1N4148
SYMBOL diode 11968 224 M0
SYMATTR InstName D8
SYMATTR Value 1N4148
SYMBOL res 11968 688 M0
SYMATTR InstName R46
SYMATTR Value 10k
SYMBOL npn 5952 1744 R270
SYMATTR InstName Q15
SYMATTR Value 2N5551
SYMBOL npn 6064 2496 M0
SYMATTR InstName Q16
SYMATTR Value 2N5551
SYMBOL res 6352 2304 M180
WINDOW 0 36 76 Left 2
WINDOW 3 36 40 Left 2
SYMATTR InstName R6
SYMATTR Value 6.8k
SYMBOL res 6352 2688 M180
WINDOW 0 36 76 Left 2
WINDOW 3 36 40 Left 2
SYMATTR InstName R27
SYMATTR Value 2.5k
SYMBOL current 6496 2432 R0
WINDOW 123 0 0 Left 0
WINDOW 39 0 0 Left 0
SYMATTR InstName I5
SYMATTR Value 7m
SYMBOL res 5872 1856 R270
WINDOW 0 32 56 VTop 2
WINDOW 3 0 56 VBottom 2
SYMATTR InstName R28
SYMATTR Value 10k
SYMBOL pnp 5776 2112 M180
SYMATTR InstName Q17
SYMATTR Value 2N5401
SYMBOL pnp 5648 2112 R180
SYMATTR InstName Q18
SYMATTR Value 2N5401
SYMBOL res 5600 2384 M0
SYMATTR InstName R29
SYMATTR Value 100k
SYMBOL cap 5824 2496 R0
SYMATTR InstName C6
SYMATTR Value 47µ
SYMBOL cap 6112 2592 R0
SYMATTR InstName C7
SYMATTR Value 1µ
SYMBOL res 5568 1792 R0
SYMATTR InstName R30
SYMATTR Value 510
SYMBOL cap 5696 1808 R0
SYMATTR InstName C18
SYMATTR Value 1µ
TEXT 3096 48 Left 2 !.tran 10m
TEXT 2280 552 Left 2 !.step param Vbat list 3.4 3.6 3.8 4 4.2 4.5 5.6 7 8
TEXT 2296 480 Left 2 !.param ripple = 100m

The netlist it stands for:
* complete_linear_regulator.asc
V5 pos 0 PULSE({Vbat - ripple } {Vbat + ripple } 0 0 0 20u 40u)
Q1 pos N006 vout+ 0 2N5551
R2 N035 N034 1k
Q2 N034 N035 vout- 0 2N5401
C3 0 N035 47µ
R4 N006 pos 1k
R10 N034 neg 1m
C4 N006 0 47µ
Q3 N006 N015 0 0 2N5551
R12 N015 N006 100k
R13 0 N015 22k
Q4 N035 N026 0 0 2N5401
R11 N026 N035 100k
R14 0 N026 22k
I1 vout+ vout- 7m
R3 N026 N035 1Meg
R5 N006 N015 1Meg
V1 0 neg PULSE({Vbat - ripple } {Vbat + ripple } 0 0 0 20u 40u)
Q5 pos N007 N001 0 2N5551
R7 N037 N036 1k
Q6 N036 N037 N038 0 2N5401
C1 0 N037 47µ
R8 N007 pos 1k
R9 N036 neg 1m
C2 N007 0 47µ
Q7 N007 N016 0 0 2N5551
R15 N016 N007 10k
R16 0 N016 2.2k
Q8 N037 N028 0 0 2N5401
R17 N028 N037 10k
R18 0 N028 2.2k
I2 N001 N038 7m
Q9 pos N009 N003 0 2N5551
Q11 N009 N022 0 0 2N5551
R20 N019 N003 78k
R21 0 N019 68k
I3 N003 0 7m
R26 pos N009 10k
I4 pos N009 1m
Q10 pos N008 N002 0 2N5551
Q12 N008 N021 0 0 2N5551
R1 N021 N002 68k
R19 0 N021 22k
I6 N002 0 7m
R22 pos N008 10k
Q13 N009 N019 N022 0 2N5551
Q14 pos N010 N004 0 2N5551
Q21 N010 N032 0 0 2N5551
R23 N025 N004 78k
R24 0 N025 68k
I7 N004 0 7m
R25 pos N010 10k
Q22 N010 N025 N032 0 2N5551
Q24 N010 N018 pos 0 2N5401
Q25 N018 N018 pos 0 2N5401
Q26 N018 N023 N027 0 2N5551
R35 N027 0 600
D3 N030 0 1N4148
D4 N023 N030 1N4148
R36 N023 pos 10k
Q23 pos N011 N005 0 2N5551
Q27 N011 N033 0 0 2N5551
R33 N033 N005 6.8k
R34 0 N033 2.5k
I8 N005 0 7m
R37 pos N011 10k
Q29 N011 N020 pos 0 2N5401
Q30 N020 N020 N017 0 2N5401
Q31 N020 N024 N029 0 2N5551
R38 N029 0 6k
D1 N031 0 1N4148
D2 N024 N031 1N4148
C5 N011 0 47µ
C8 N010 0 47µ
C9 N008 0 1µ
C10 N033 0 1µ
R40 pos N017 3k
C11 N024 0 1µ
C12 pos N020 1µ
Q28 pos N046 N045 0 2N5551
Q32 N046 N052 0 0 2N5551
R41 N052 N045 6.8k
R42 0 N052 2.5k
I9 N045 0 7m
R43 pos N046 10k
Q33 N046 N049 N047 0 2N5401
Q34 N049 N049 N048 0 2N5401
R44 N049 0 6k
D5 N051 0 1N4148
D6 N050 N051 1N4148
R45 N050 pos 100k
C13 N046 0 47µ
C14 N052 0 1µ
C15 N050 0 1µ
Q36 N047 N047 pos 0 2N5401
Q35 N048 N047 pos 0 2N5401
C16 N009 0 47µ
Q37 N024 N014 N013 0 2N5401
R39 pos N013 1k
D7 N012 N014 1N4148
D8 pos N012 1N4148
R46 N014 0 10k
Q15 pos N041 N040 0 2N5551
Q16 N041 N044 0 0 2N5551
R6 N044 N040 6.8k
R27 0 N044 2.5k
I5 N040 0 7m
R28 pos N041 10k
Q17 N041 N043 pos 0 2N5401
Q18 N043 N043 N042 0 2N5401
R29 N043 0 100k
C6 N041 0 47µ
C7 N044 0 1µ
R30 pos N042 510
C18 pos N043 1µ
.model D D
.lib standard.dio
.model NPN NPN
.model PNP PNP
.lib standard.bjt
.tran 10m
.step param Vbat list 3.4 3.6 3.8 4 4.2 4.5 5.6 7 8
.param ripple = 100m
.backanno
.end